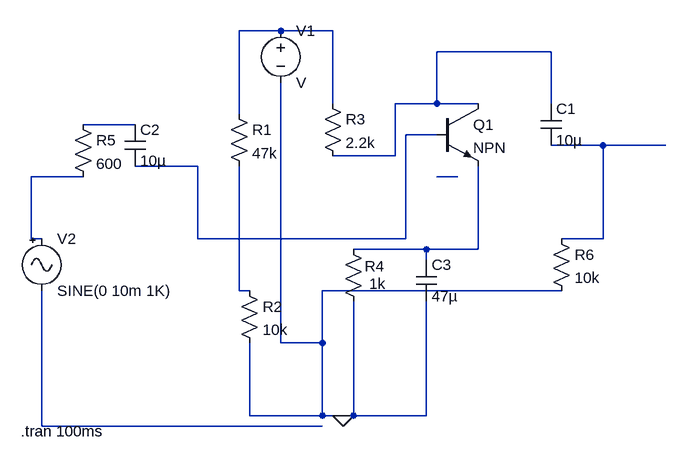
[diagram p0: schematic cebjt.asc]
cebjt.asc, the LTspice schematic file:
Version 4.1
SHEET 1 880 680
WIRE 176 16 112 16
WIRE 256 16 176 16
WIRE 592 48 416 48
WIRE 256 128 256 16
WIRE 416 128 416 48
WIRE 416 128 352 128
WIRE 480 128 416 128
WIRE 592 128 592 48
WIRE 112 144 112 16
WIRE -48 160 -128 160
WIRE 416 176 368 176
WIRE 672 192 592 192
WIRE 768 192 672 192
WIRE 352 208 352 128
WIRE 352 208 256 208
WIRE 48 224 -48 224
WIRE -128 240 -208 240
WIRE 448 240 416 240
WIRE -208 336 -208 240
WIRE -192 336 -208 336
WIRE 48 336 48 224
WIRE 368 336 368 176
WIRE 368 336 48 336
WIRE 672 336 672 192
WIRE 672 336 608 336
WIRE 400 352 288 352
WIRE 480 352 480 224
WIRE 480 352 400 352
WIRE 400 368 400 352
WIRE 112 416 112 224
WIRE 128 416 112 416
WIRE 608 416 240 416
WIRE 176 496 176 96
WIRE 240 496 240 416
WIRE 240 496 176 496
WIRE 128 608 128 496
WIRE 240 608 240 496
WIRE 240 608 128 608
WIRE 272 608 240 608
WIRE 288 608 288 432
WIRE 288 608 272 608
WIRE 400 608 400 432
WIRE 400 608 288 608
WIRE -192 624 -192 416
WIRE 240 624 -192 624
FLAG 272 608 0
SYMBOL voltage 176 0 R0
SYMATTR InstName V1
SYMBOL res 96 128 R0
SYMATTR InstName R1
SYMATTR Value 47k
SYMBOL res 112 400 R0
SYMATTR InstName R2
SYMATTR Value 10k
SYMBOL res 240 112 R0
SYMATTR InstName R3
SYMATTR Value 2.2k
SYMBOL res 272 336 R0
WINDOW 0 33 42 Left 2
WINDOW 3 40 69 Left 2
SYMATTR InstName R4
SYMATTR Value 1k
SYMBOL npn 416 128 R0
SYMATTR InstName Q1
SYMBOL res -144 144 R0
SYMATTR InstName R5
SYMATTR Value 600
SYMBOL res 592 320 R0
SYMATTR InstName R6
SYMATTR Value 10k
SYMBOL cap 576 128 R0
SYMATTR InstName C1
SYMATTR Value 10µ
SYMBOL cap -64 160 R0
SYMATTR InstName C2
SYMATTR Value 10µ
SYMBOL cap 384 368 R0
SYMATTR InstName C3
SYMATTR Value 47µ
SYMBOL Misc\\signal -192 320 R0
WINDOW 123 0 0 Left 0
WINDOW 39 0 0 Left 0
SYMATTR InstName V2
SYMATTR Value SINE(0 10m 1K)
TEXT -224 632 Left 2 !.tran 100ms

The netlist it stands for:
* cebjt.asc
V1 N001 0 V
R1 N001 N009 47k
R2 N009 0 10k
R3 N001 N002 2.2k
R4 N008 0 1k
Q1 N002 N004 N008 0 NPN
R5 N003 N006 600
R6 N005 0 10k
C1 N002 N005 10µ
C2 N003 N004 10µ
C3 N008 0 47µ
V2 N006 N010 SINE(0 10m 1K)
.model NPN NPN
.model PNP PNP
.lib standard.bjt
.tran 100ms
.backanno
.end